# Altium schematic sheet test_powersupply.schdoc
size 217 x 165 mm
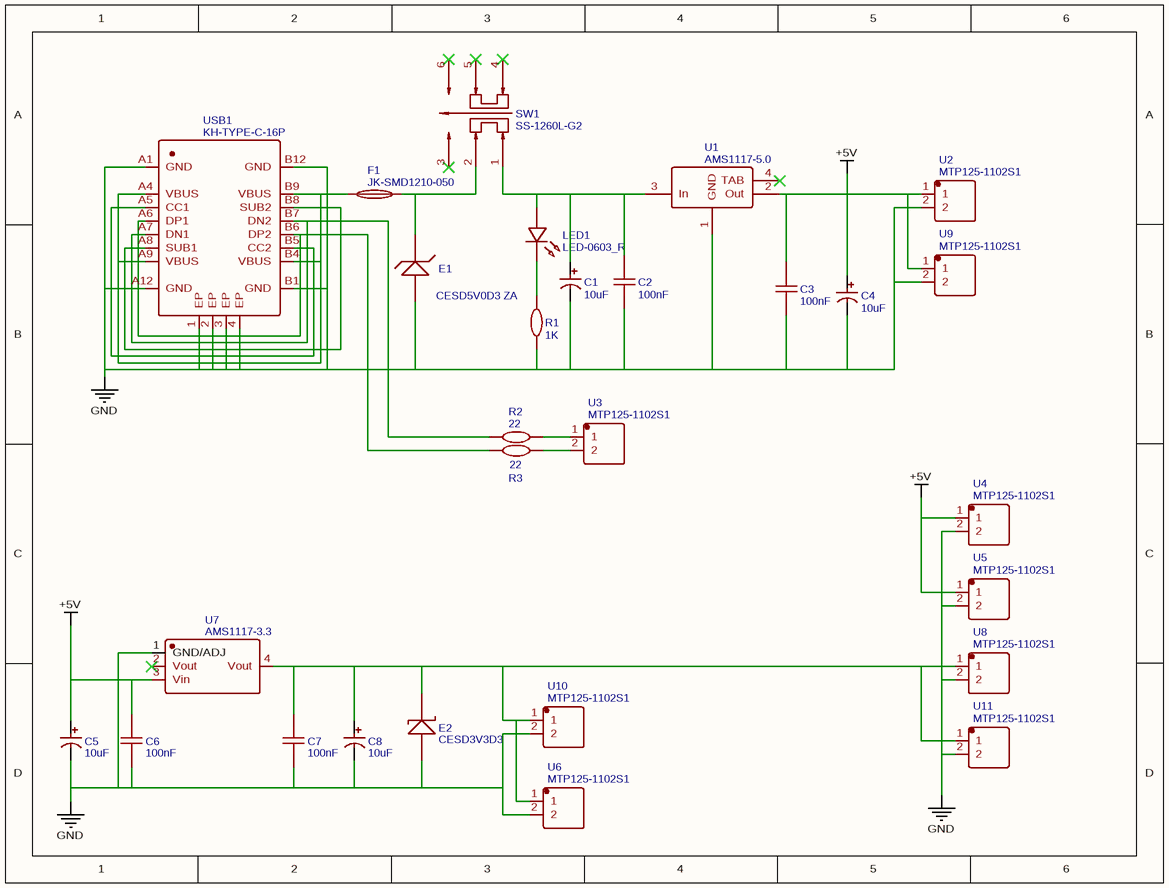
[diagram p0: test_powersupply.schdoc]

## Parts
C1  10uF  [CAP-SMD_BD4.0-L4.3-W4.3-FD]
C2  100nF  [C0603]
C3  100nF  [C0603]
C4  10uF  [CAP-SMD_BD4.0-L4.3-W4.3-FD]
C5  10uF  [CAP-SMD_BD4.0-L4.3-W4.3-FD]
C6  100nF  [C0603]
C7  100nF  [C0603]
C8  10uF  [CAP-SMD_BD4.0-L4.3-W4.3-FD]
E1  CESD5V0D3 ZA  [SOD-323_L1.8-W1.3-LS2.5-RD]
E2  CESD3V3D3  [SOD-323_L1.8-W1.3-LS2.5-RD]
F1  JK-SMD1210-050  [F1210]
LED1  LED-0603_R  [LED0603_RED]
R1  1K  [R0603]
R2  22  [R0603]
R3  22  [R0603]
SW1  SS-1260L-G2  [SW-SMD_SS-1260L-G2]
U1  AMS1117-5.0  [SOT-223_L6.5-W3.5-P2.30-LS7.0-BR]
U2  MTP125-1102S1  [HDR-TH_2P-P2.54-V]
U3  MTP125-1102S1  [HDR-TH_2P-P2.54-V]
U4  MTP125-1102S1  [HDR-TH_2P-P2.54-V]
U5  MTP125-1102S1  [HDR-TH_2P-P2.54-V]
U6  MTP125-1102S1  [HDR-TH_2P-P2.54-V]
U7  AMS1117-3.3  [SOT-223-3_L6.5-W3.4-P2.30-LS7.0-BR]
U8  MTP125-1102S1  [HDR-TH_2P-P2.54-V]
U9  MTP125-1102S1  [HDR-TH_2P-P2.54-V]
U10  MTP125-1102S1  [HDR-TH_2P-P2.54-V]
U11  MTP125-1102S1  [HDR-TH_2P-P2.54-V]
USB1  KH-TYPE-C-16P  [USB-C-SMD_KH-TYPE-C-16P]

## Nets
+5V: C3.2 C4.1 C5.1 C6.1 U1.2(Out) U2.1 U4.1 U5.1 U7.3(Vin) U9.1
GND: C1.2 C2.1 C3.1 C4.2 C5.2 C6.2 C7.2 C8.2 E1.2 E2.2 R1.1 U1.1(GND) U2.2 U4.2 U5.2 U6.2 U7.1(GND/ADJ) U8.2 U9.2 U10.2 U11.2 USB1.1(EP) USB1.2(EP) USB1.3(EP) USB1.4(EP) USB1.A1(GND) USB1.A12(GND) USB1.B1(GND) USB1.B12(GND)
NetC1_1: C1.1 C2.2 LED1.1 SW1.1 U1.3(In)
NetC7_1: C7.1 C8.1 E2.1 U6.1 U7.4(Vout) U8.1 U10.1 U11.1
NetE1_1: E1.1 F1.2 SW1.2
NetF1_1: F1.1 USB1.A4(VBUS) USB1.A9(VBUS) USB1.B4(VBUS) USB1.B9(VBUS)
NetLED1_2: LED1.2 R1.2
NetR2_1: R2.1 USB1.A7(DN1) USB1.B7(DN2)
NetR2_2: R2.2 U3.1
NetR3_1: R3.1 USB1.A6(DP1) USB1.B6(DP2)
NetR3_2: R3.2 U3.2
NetUSB1_A5: USB1.A5(CC1) USB1.B5(CC2)
NetUSB1_A8: USB1.A8(SUB1) USB1.B8(SUB2)

Not connected (* = marked no-connect by the designer): SW1 3* 4* 5* 6*; U1 4(TAB)*; U7 2(Vout)*

## Library data of the parts
C1 C4 C5 C8 = 10uF: BOM_Manufacturer: HONOR; BOM_Manufacturer Part: RVT1C100M0405; nameAlias: Capacitance; BOM_Supplier: LCSC; BOM_Supplier Part: C3357; spicePre: C; spiceSymbolName: RVT1C100M0405
C2 C3 C6 C7 = 100nF: BOM_Manufacturer: Holy Stone Enterprise; BOM_Manufacturer Part: C0603X104K050T; nameAlias: Capacitance; Contributor: LCSC; BOM_Supplier: LCSC; BOM_Supplier Part: C187860; spicePre: C; spiceSymbolName: C0603X104K050T
E1 = CESD5V0D3 ZA: BOM_Manufacturer: CJ; SMT Type: Extend; BOM_Supplier: LCSC; BOM_Manufacturer Part: CESD5V0D3 ZA; image: //image.lceda.cn/szlcsc/C22643.jpg; BOM_Supplier Part: C22643; BOM_JLCPCB SMD: Yes; spicePre: E; spiceSymbolName: CESD5V0D3 ZA
E2 = CESD3V3D3: BOM_Manufacturer: CJ; SMT Type: Extend; BOM_Supplier: LCSC; BOM_Manufacturer Part: CESD3V3D3; image: //image.lceda.cn/szlcsc/C38388.jpg; BOM_Supplier Part: C38388; BOM_JLCPCB SMD: Yes; spicePre: E; spiceSymbolName: CESD3V3D3
F1 = JK-SMD1210-050: BOM_Manufacturer: Jinrui Electronic Materials Co.; Contributor: LCSC; BOM_Supplier: LCSC; BOM_Supplier Part: C409805; BOM_Manufacturer Part: JK-SMD1210-050; spicePre: F; spiceSymbolName: JK-SMD1210-050
LED1 = LED-0603_R: BOM_Manufacturer: EVERLIGHT(台湾亿光); BOM_Manufacturer Part: 19-217/R6C-AL1M2VY/3T; Contributor: LCEDA_01; BOM_Supplier Part: C72044; BOM_Supplier: LCSC; spicePre: L; spiceSymbolName: LED-0603_R
R1 = 1K: BOM_Manufacturer: YAGEO; BOM_Manufacturer Part: RT0603FRE071KL; nameAlias: Resistance (Ohms); Contributor: LCSC; BOM_Supplier: LCSC; BOM_Supplier Part: C375503; spicePre: R; spiceSymbolName: RT0603FRE071KL
R2 R3 = 22: BOM_Manufacturer: WALSIN; BOM_Manufacturer Part: WR06X22R0FTL; nameAlias: Resistance (Ohms); Contributor: LCSC; BOM_Supplier: LCSC; BOM_Supplier Part: C163887; spicePre: R; spiceSymbolName: WR06X22R0FTL
SW1 = SS-1260L-G2: BOM_Manufacturer: RI SHENG; Contributor: LCSC; BOM_Supplier: LCSC; BOM_Supplier Part: C589310; BOM_Manufacturer Part: SS-1260L-G2; spicePre: S; spiceSymbolName: SS-1260L-G2
U1 = AMS1117-5.0: BOM_Manufacturer: AMS; sourceId: HltLFyQwq; SMT Type: Basic; timeStamp: 1466676067; BOM_Supplier: LCSC; BOM_Manufacturer Part: AMS1117-5.0; image: //image.lceda.cn/szlcsc/C6187.jpg; BOM_Supplier Part: C6187; BOM_JLCPCB SMD: Yes; spicePre: U; spiceSymbolName: AMS1117-5.0
U2-U6 U8-U11 = MTP125-1102S1: BOM_Manufacturer: MINTRON; Contributor: LCSC; BOM_Paste Type: expand; BOM_Assembly Type: manualWeld; BOM_Supplier: LCSC; BOM_Supplier Part: C358684; BOM_Manufacturer Part: MTP125-1102S1; spicePre: U; spiceSymbolName: MTP125-1102S1
U7 = AMS1117-3.3: BOM_Manufacturer: AMS; sourceId: dwIGgezVh; SMT Type: Basic; timeStamp: 1476261164; BOM_Supplier: LCSC; BOM_Manufacturer Part: AMS1117-3.3; image: //image.lceda.cn/szlcsc/C6186.jpg; BOM_Supplier Part: C6186; BOM_JLCPCB SMD: Yes; spicePre: U; spiceSymbolName: AMS1117-3.3
USB1 = KH-TYPE-C-16P: BOM_Manufacturer: Shenzhen Kinghelm Elec; Contributor: LCSC; BOM_Supplier: LCSC; BOM_Supplier Part: C709357; BOM_Manufacturer Part: KH-TYPE-C-16P; spicePre: U; spiceSymbolName: KH-TYPE-C-16P